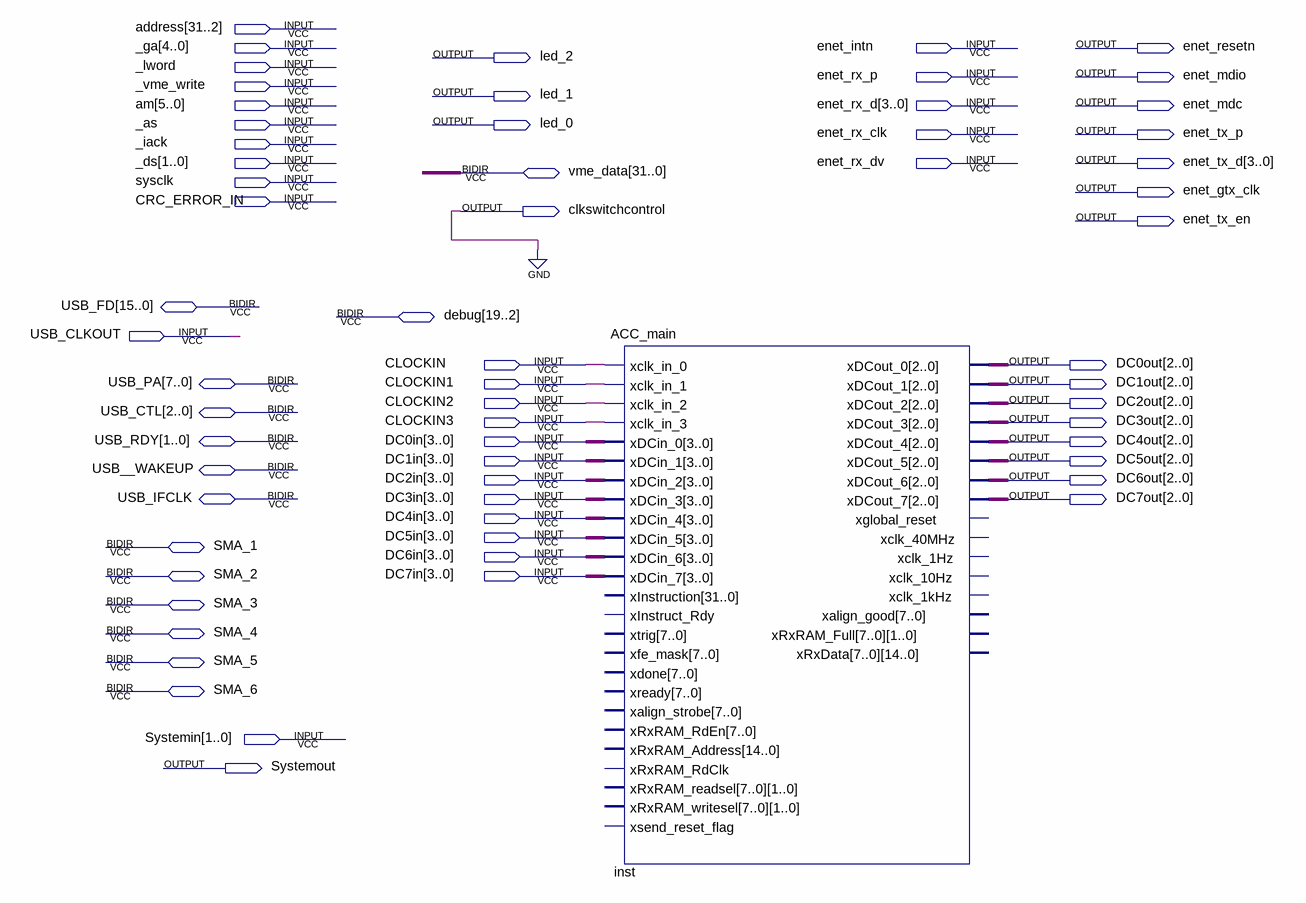
[diagram p0: schematic sheet]
// Quartus schematic ACC_top_v0_1.bdf as structural Verilog: 1 symbols, 63 pins
module ACC_top_v0_1 (
  input  [31:2] address,
  input  [4:0] _ga,
  input  enet_intn,
  input  _lword,
  input  enet_rx_p,
  input  _vme_write,
  input  [5:0] am,
  input  [3:0] enet_rx_d,
  input  _as,
  input  enet_rx_clk,
  input  _iack,
  input  [1:0] _ds,
  input  enet_rx_dv,
  input  sysclk,
  input  CRC_ERROR_IN,
  input  USB_CLKOUT,
  input  CLOCKIN,
  input  CLOCKIN1,
  input  CLOCKIN2,
  input  CLOCKIN3,
  input  [3:0] DC0in,
  input  [3:0] DC1in,
  input  [3:0] DC2in,
  input  [3:0] DC3in,
  input  [3:0] DC4in,
  input  [3:0] DC5in,
  input  [3:0] DC6in,
  input  [3:0] DC7in,
  input  [1:0] Systemin,
  inout  [31:0] vme_data,
  inout  [15:0] USB_FD,
  inout  [19:2] debug,
  inout  [7:0] USB_PA,
  inout  [2:0] USB_CTL,
  inout  [1:0] USB_RDY,
  inout  USB__WAKEUP,
  inout  USB_IFCLK,
  inout  SMA_1,
  inout  SMA_2,
  inout  SMA_3,
  inout  SMA_4,
  inout  SMA_5,
  inout  SMA_6,
  output enet_resetn,
  output led_2,
  output enet_mdio,
  output led_1,
  output enet_mdc,
  output led_0,
  output enet_tx_p,
  output [3:0] enet_tx_d,
  output enet_gtx_clk,
  output clkswitchcontrol,
  output enet_tx_en,
  output [2:0] DC0out,
  output [2:0] DC1out,
  output [2:0] DC2out,
  output [2:0] DC3out,
  output [2:0] DC4out,
  output [2:0] DC5out,
  output [2:0] DC6out,
  output [2:0] DC7out,
  output Systemout
);

  ACC_main inst (
    .xclk_in_0(CLOCKIN), .xclk_in_1(CLOCKIN1), .xclk_in_2(CLOCKIN2), .xclk_in_3(CLOCKIN3), .xDCin_0(DC0in),
    .xDCin_1(DC1in), .xDCin_2(DC2in), .xDCin_3(DC3in), .xDCin_4(DC4in), .xDCin_5(DC5in), .xDCin_6(DC6in),
    .xDCin_7(DC7in), .xDCout_0(DC0out), .xDCout_1(DC1out), .xDCout_2(DC2out), .xDCout_3(DC3out),
    .xDCout_4(DC4out), .xDCout_5(DC5out), .xDCout_6(DC6out), .xDCout_7(DC7out));  // open: xInstruction, xInstruct_Rdy, xtrig, xfe_mask, xdone, xready, xalign_strobe, xRxRAM_RdEn, xRxRAM_Address, xRxRAM_RdClk, xRxRAM_readsel, xRxRAM_writesel, xsend_reset_flag, xglobal_reset, xclk_40MHz, xclk_1Hz, xclk_10Hz, xclk_1kHz, xalign_good, xRxRAM_Full, xRxData

  assign clkswitchcontrol = 1'b0;
endmodule
